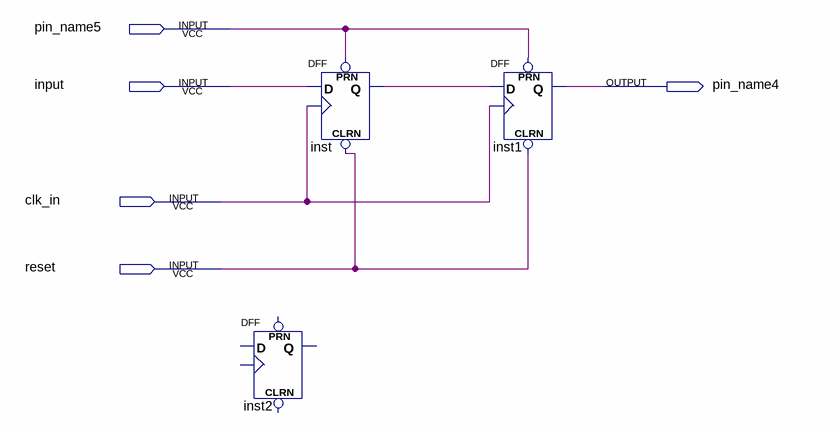
[diagram p0: schematic sheet]
// Quartus schematic Block2.bdf as structural Verilog: 3 symbols, 5 pins
module Block2 (
  input  pin_name5,
  input  \input ,
  input  clk_in,
  input  reset,
  output pin_name4
);

  wire inst_q;

  DFF inst (.CLRN(reset), .CLK(clk_in), .D(\input ), .PRN(pin_name5), .Q(inst_q));
  DFF inst2 ();  // open: CLRN, CLK, D, PRN, Q
  DFF inst1 (.CLRN(reset), .CLK(clk_in), .D(inst_q), .PRN(pin_name5), .Q(pin_name4));
endmodule
